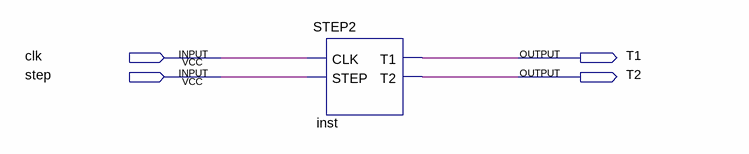
[diagram p0: schematic sheet]
// Quartus schematic steper.bdf as structural Verilog: 1 symbols, 4 pins
module steper (
  input  clk,
  input  step,
  output T1,
  output T2
);

  STEP2 inst (.CLK(clk), .STEP(step), .T1(T1), .T2(T2));
endmodule
